# Altium schematic sheet RGB_LED.SchDoc
size A; SheetNumber: 7; SheetTotal: 8
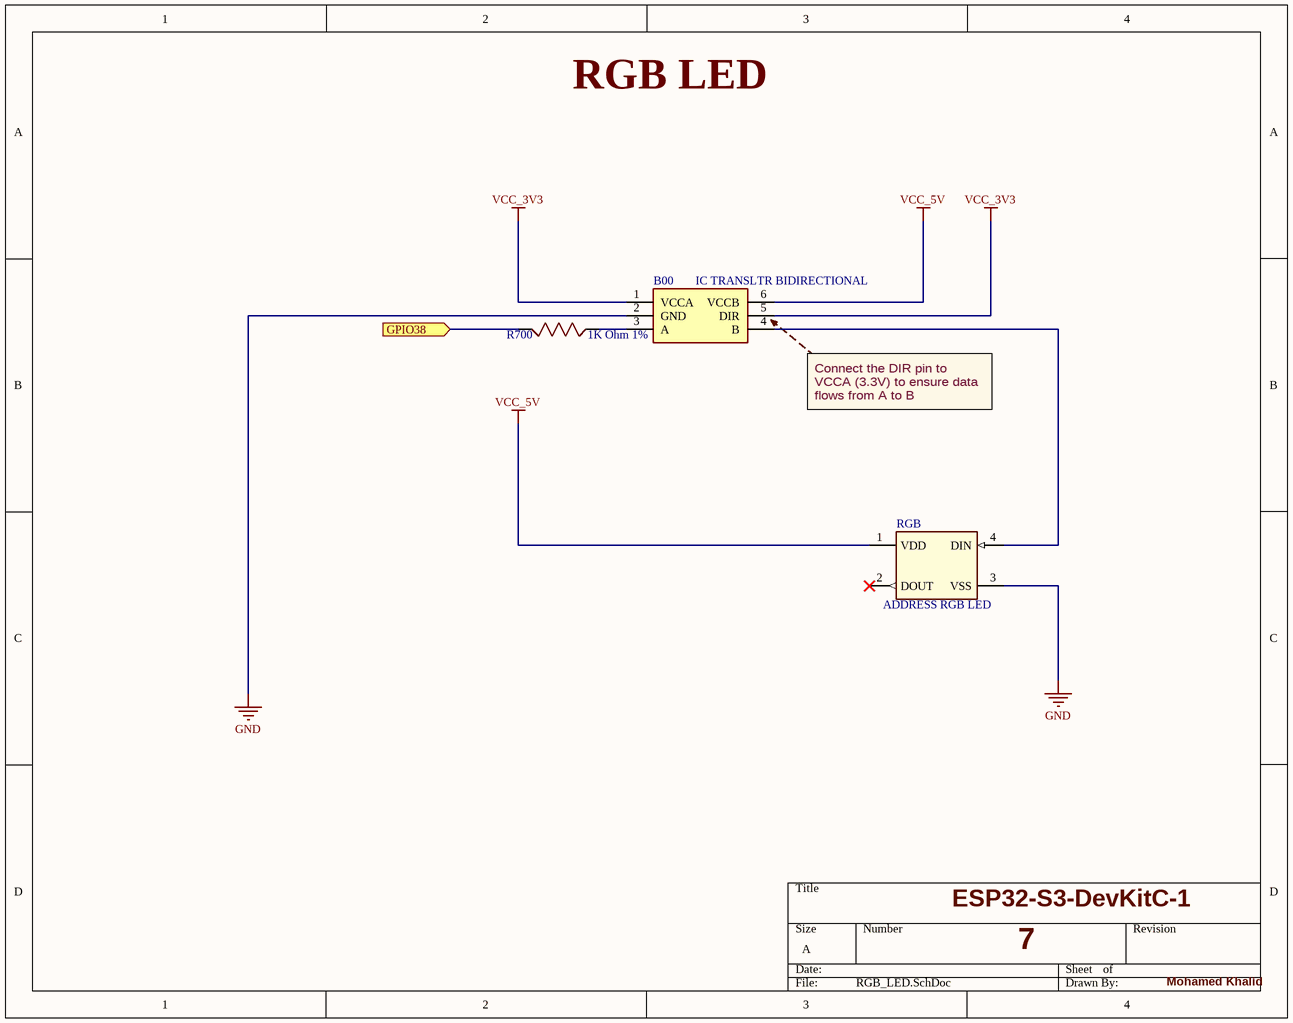
[diagram p0: RGB_LED.SchDoc]

## Parts
B00  IC TRANSLTR BIDIRECTIONAL  [SOTFL50P160X60-6N]
R700  1K Ohm 1%  [RESC2012X65N]
RGB  ADDRESS RGB LED  [COM-16347_SPK]

## Ports
GPIO38 (in, see ESP32-S3-WROOM-1U[3B], PIN-HEADERS[3B])

## Nets
GND: B00.2(GND) RGB.3(VSS)
VCC_3V3: B00.1(VCCA) B00.5(DIR)
VCC_5V: B00.6(VCCB) RGB.1(VDD)
GPIO38: R700.1 ; port GPIO38
NetB00_3: B00.3(A) R700.2
NetB00_4: B00.4(B) RGB.4(DIN)

Not connected (* = marked no-connect by the designer): RGB 2(DOUT)*

## Notes on the sheet
- RGB LED
- Connect the DIR pin to VCCA (3.3V) to ensure data flows from A to B
- ESP32-S3-DevKitC-1
- 7
- Mohamed Khalid

## Library data of the parts
B00 = SN74LVC1T45DRLR: Voltage Level Translator Bidirectional 1 Circuit 1 Channel 420Mbps SOT-5X3; Voltage - VCCA: 1.65 V ~ 5.5 V; Translator Type: Voltage Level; Channel Type: Bidirectional; Voltage - VCCB: 1.65 V ~ 5.5 V
R700 = RMCF0805FT1K00: 1 kOhms ±1% 0.125W, 1/8W Chip Resistor 0805 (2012 Metric) Automotive AEC-Q200 Thick Film; Value: 1K OHM; Tolerance: ± 1%; Power (Watts): 0.125W, 1/8W
RGB = COM-16347: Addressable Lighting - LED Serial NRZ (Shift Register) Red, Green, Blue (RGB) 5.00mm L x 5.00mm W; Power supply voltage: +3.5~+5.3; Red Voltage(V): 2.0-2.2; Green Voltage(V): 3.0-3.4; Type: LED Addressable; Blue Voltage(V): 3.0-3.4